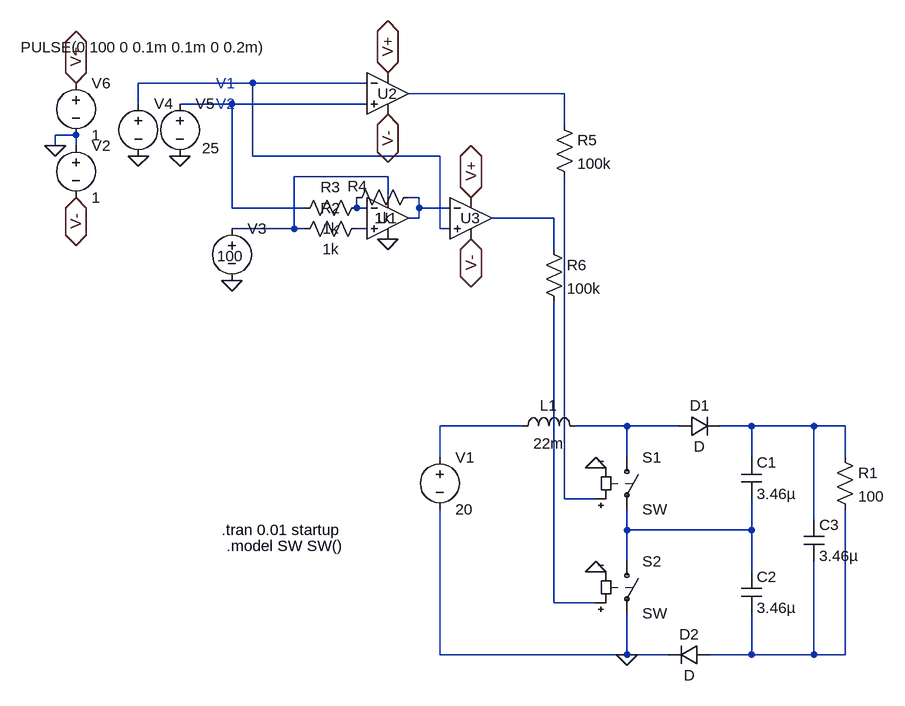
[diagram p0: schematic BoostconverterD.asc]
BoostconverterD.asc, the LTspice schematic file:
Version 4
SHEET 1 1428 680
WIRE -448 -448 -624 -448
WIRE -272 -448 -448 -448
WIRE 32 -432 -208 -432
WIRE -624 -416 -624 -448
WIRE -480 -416 -560 -416
WIRE -272 -416 -480 -416
WIRE 32 -384 32 -432
WIRE -720 -368 -752 -368
WIRE -752 -352 -752 -368
WIRE -720 -352 -720 -368
WIRE -448 -336 -448 -448
WIRE -160 -336 -448 -336
WIRE -240 -304 -384 -304
WIRE -240 -272 -240 -304
WIRE -192 -272 -208 -272
WIRE -480 -256 -480 -416
WIRE -368 -256 -480 -256
WIRE -288 -256 -288 -272
WIRE -272 -256 -288 -256
WIRE -192 -256 -192 -272
WIRE -144 -256 -192 -256
WIRE -192 -240 -192 -256
WIRE -192 -240 -208 -240
WIRE 16 -240 -80 -240
WIRE -384 -224 -384 -304
WIRE -384 -224 -480 -224
WIRE -368 -224 -384 -224
WIRE -272 -224 -288 -224
WIRE -160 -224 -160 -336
WIRE -144 -224 -160 -224
WIRE 16 -192 16 -240
WIRE -32 80 -160 80
WIRE 128 80 48 80
WIRE 208 80 128 80
WIRE 320 80 272 80
WIRE 416 80 320 80
WIRE 464 80 416 80
WIRE -160 128 -160 80
WIRE 128 128 128 80
WIRE 320 128 320 80
WIRE 464 128 464 80
WIRE 32 192 32 -304
WIRE 80 192 32 192
WIRE 416 224 416 80
WIRE 128 240 128 208
WIRE 320 240 320 192
WIRE 320 240 128 240
WIRE 128 288 128 240
WIRE 320 304 320 240
WIRE 16 352 16 -112
WIRE 80 352 16 352
WIRE -160 432 -160 208
WIRE 128 432 128 368
WIRE 128 432 -160 432
WIRE 192 432 128 432
WIRE 320 432 320 368
WIRE 320 432 256 432
WIRE 416 432 416 288
WIRE 416 432 320 432
WIRE 464 432 464 208
WIRE 464 432 416 432
FLAG -624 -336 0
FLAG -560 -336 0
FLAG -752 -352 0
FLAG 128 432 0
FLAG 80 304 0
FLAG 80 144 0
FLAG -240 -464 V+
IOPIN -240 -464 BiDir
FLAG -720 -448 V+
IOPIN -720 -448 BiDir
FLAG -720 -272 V-
IOPIN -720 -272 BiDir
FLAG -240 -400 V-
IOPIN -240 -400 BiDir
FLAG -112 -272 V+
IOPIN -112 -272 BiDir
FLAG -112 -208 V-
IOPIN -112 -208 BiDir
FLAG -480 -144 0
FLAG -240 -208 0
SYMBOL voltage -160 112 R0
WINDOW 123 0 0 Left 2
WINDOW 39 0 0 Left 2
SYMATTR InstName V1
SYMATTR Value 20
SYMBOL res 448 112 R0
SYMATTR InstName R1
SYMATTR Value 100
SYMBOL cap 304 128 R0
SYMATTR InstName C1
SYMATTR Value 3.46µ
SYMBOL ind -48 96 R270
WINDOW 0 32 56 VTop 2
WINDOW 3 5 56 VBottom 2
SYMATTR InstName L1
SYMATTR Value 22m
SYMBOL diode 208 96 R270
WINDOW 0 32 32 VTop 2
WINDOW 3 0 32 VBottom 2
SYMATTR InstName D1
SYMBOL sw 128 112 R0
SYMATTR InstName S1
SYMBOL Opamps\\UniversalOpamp2 -240 -432 R0
WINDOW 0 -16 0 Left 2
SYMATTR InstName U2
SYMBOL voltage -624 -432 R0
WINDOW 3 -181 -71 Left 2
WINDOW 123 0 0 Left 2
WINDOW 39 0 0 Left 2
SYMATTR Value PULSE(0 100 0 0.1m 0.1m 0 0.2m)
SYMATTR InstName V4
SYMBOL voltage -560 -432 R0
WINDOW 123 0 0 Left 2
WINDOW 39 0 0 Left 2
WINDOW 3 34 84 Left 2
SYMATTR Value 25
SYMATTR InstName V5
SYMBOL voltage -720 -464 R0
WINDOW 123 0 0 Left 2
WINDOW 39 0 0 Left 2
SYMATTR InstName V6
SYMATTR Value 1
SYMBOL voltage -720 -368 R0
WINDOW 123 0 0 Left 2
WINDOW 39 0 0 Left 2
SYMATTR InstName V2
SYMATTR Value 1
SYMBOL sw 128 272 R0
SYMATTR InstName S2
SYMBOL cap 304 304 R0
SYMATTR InstName C2
SYMATTR Value 3.46µ
SYMBOL diode 256 416 R90
WINDOW 0 0 32 VBottom 2
WINDOW 3 32 32 VTop 2
SYMATTR InstName D2
SYMBOL cap 400 224 R0
SYMATTR InstName C3
SYMATTR Value 3.46µ
SYMBOL Opamps\\UniversalOpamp2 -240 -240 R0
WINDOW 0 -16 0 Left 2
SYMATTR InstName U1
SYMBOL Opamps\\UniversalOpamp2 -112 -240 R0
WINDOW 0 -16 0 Left 2
SYMATTR InstName U3
SYMBOL voltage -480 -240 R0
WINDOW 3 -23 58 Left 2
WINDOW 123 0 0 Left 2
WINDOW 39 0 0 Left 2
SYMATTR Value 100
SYMATTR InstName V3
SYMBOL res -272 -240 R90
WINDOW 0 0 56 VBottom 2
WINDOW 3 32 56 VTop 2
SYMATTR InstName R2
SYMATTR Value 1k
SYMBOL res -272 -272 R90
WINDOW 0 0 56 VBottom 2
WINDOW 3 32 56 VTop 2
SYMATTR InstName R3
SYMATTR Value 1k
SYMBOL res -192 -288 R90
WINDOW 0 14 95 VBottom 2
WINDOW 3 32 56 VTop 2
SYMATTR InstName R4
SYMATTR Value 1k
SYMBOL res 16 -400 R0
SYMATTR InstName R5
SYMATTR Value 100k
SYMBOL res 0 -208 R0
SYMATTR InstName R6
SYMATTR Value 100k
TEXT -504 -448 Left 2 ;V1
TEXT -504 -416 Left 2 ;V2
TEXT -496 240 Left 2 !.tran 0.01 startup
TEXT -488 264 Left 2 !.model SW SW()

The netlist it stands for:
* BoostconverterD.asc
V1 N009 0 20
R1 N011 N015 100
C1 N011 N013 3.46µ
L1 N009 N010 22m
D1 N010 N011 D
S1 N010 N013 N012 0 SW
XU2 N003 N001 V+ V- N002 level.2 Avol=1Meg GBW=10Meg Slew=10Meg ilimit=25m rail=0 Vos=0 phimargin=45 en=0 enk=0 in=0 ink=0 Rin=500Meg  ; pins IN+ IN- V+ V- OUT
V4 N001 0 PULSE(0 100 0 0.1m 0.1m 0 0.2m)
V5 N003 0 25
V6 V+ 0 1
V2 0 V- 1
S2 N013 0 N014 0 SW
C2 N013 N015 3.46µ
D2 N015 0 D
C3 N011 N015 3.46µ
XU1 N008 N006 N004 0 N005 level.2 Avol=1Meg GBW=10Meg Slew=10Meg ilimit=25m rail=0 Vos=0 phimargin=45 en=0 enk=0 in=0 ink=0 Rin=500Meg  ; pins IN+ IN- V+ V- OUT
XU3 N001 N005 V+ V- N007 level.2 Avol=1Meg GBW=10Meg Slew=10Meg ilimit=25m rail=0 Vos=0 phimargin=45 en=0 enk=0 in=0 ink=0 Rin=500Meg  ; pins IN+ IN- V+ V- OUT
V3 N004 0 100
R2 N008 N004 1k
R3 N006 N003 1k
R4 N005 N006 1k
R5 N002 N012 100k
R6 N007 N014 100k
.model D D
.lib standard.dio
* V1
* V2
.tran 0.01 startup
.model SW SW()
.lib UniversalOpamps2.sub
.backanno
.end